# Altium project SmartSocket V1.0.PrjPcb (part 1 of 3)
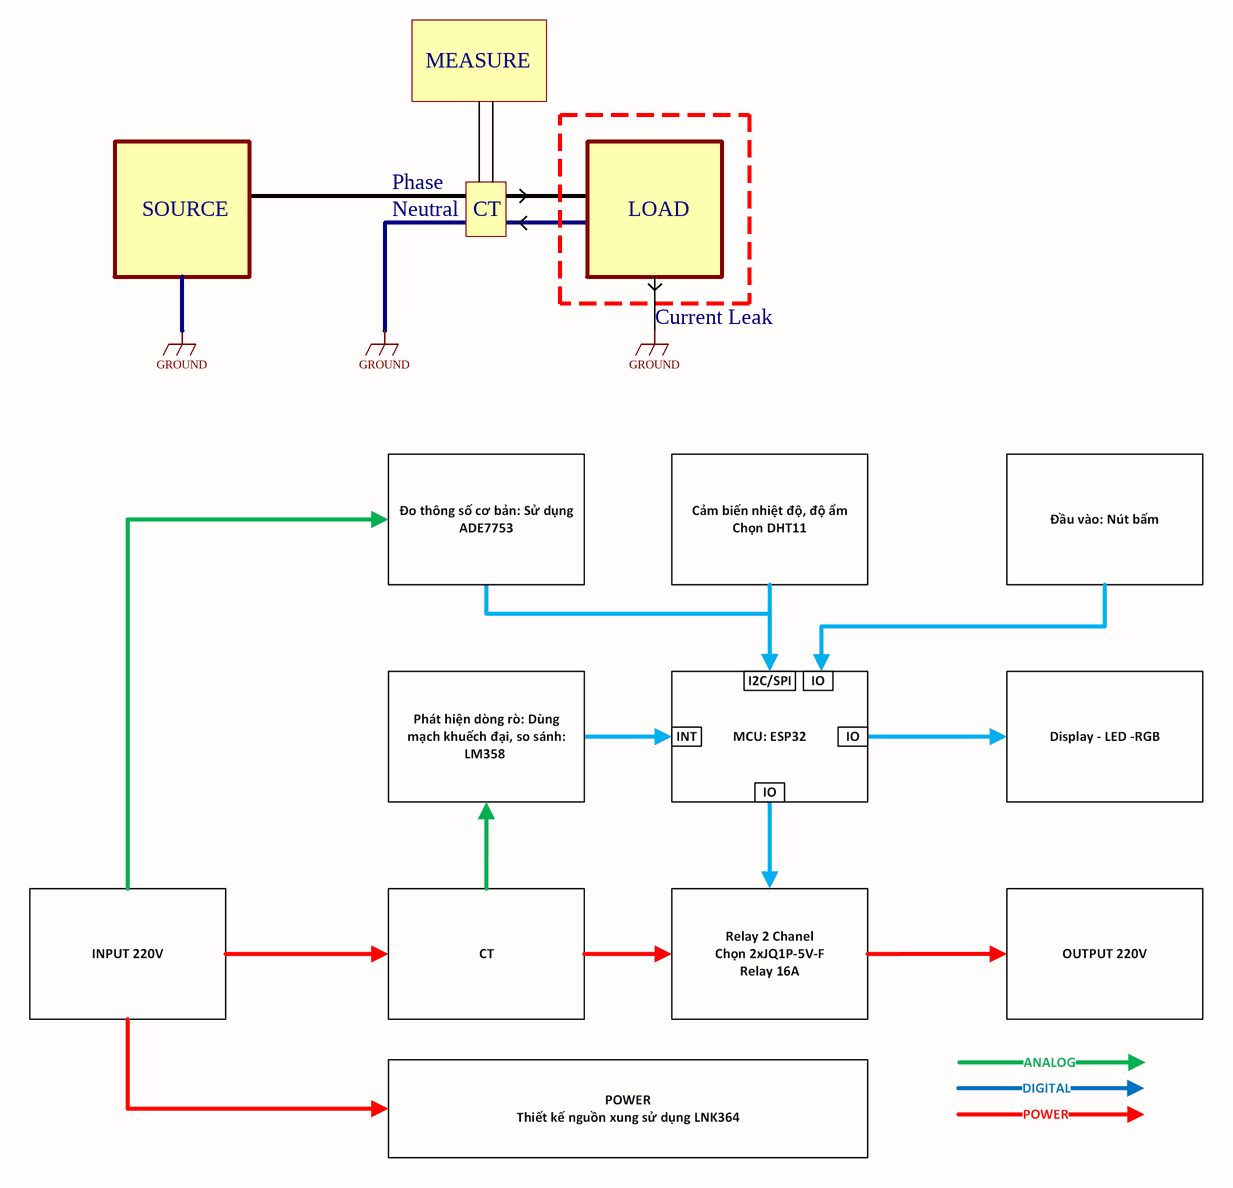
[diagram p0: DiagramElectical.SchDoc]
2 sheets, 117 parts. Net scope: global (net labels, ports and power ports of the same name join across sheets).
Board file: SmartSocket V1.0.PcbDoc
Sheets:
  DiagramElectical.SchDoc
  SmartSocket V1.0.SchDoc

## Sheet DiagramElectical.SchDoc
size A3; SheetNumber: 4; SheetTotal: 5

### Notes on the sheet
- MEASURE
- SOURCE
- Phase
- Neutral
- CT
- LOAD
- Current Leak
- Labels drawn without touching a wire or pin: GROUND

## Sheet SmartSocket V1.0.SchDoc
size A2; SheetNumber: 3; SheetTotal: 3
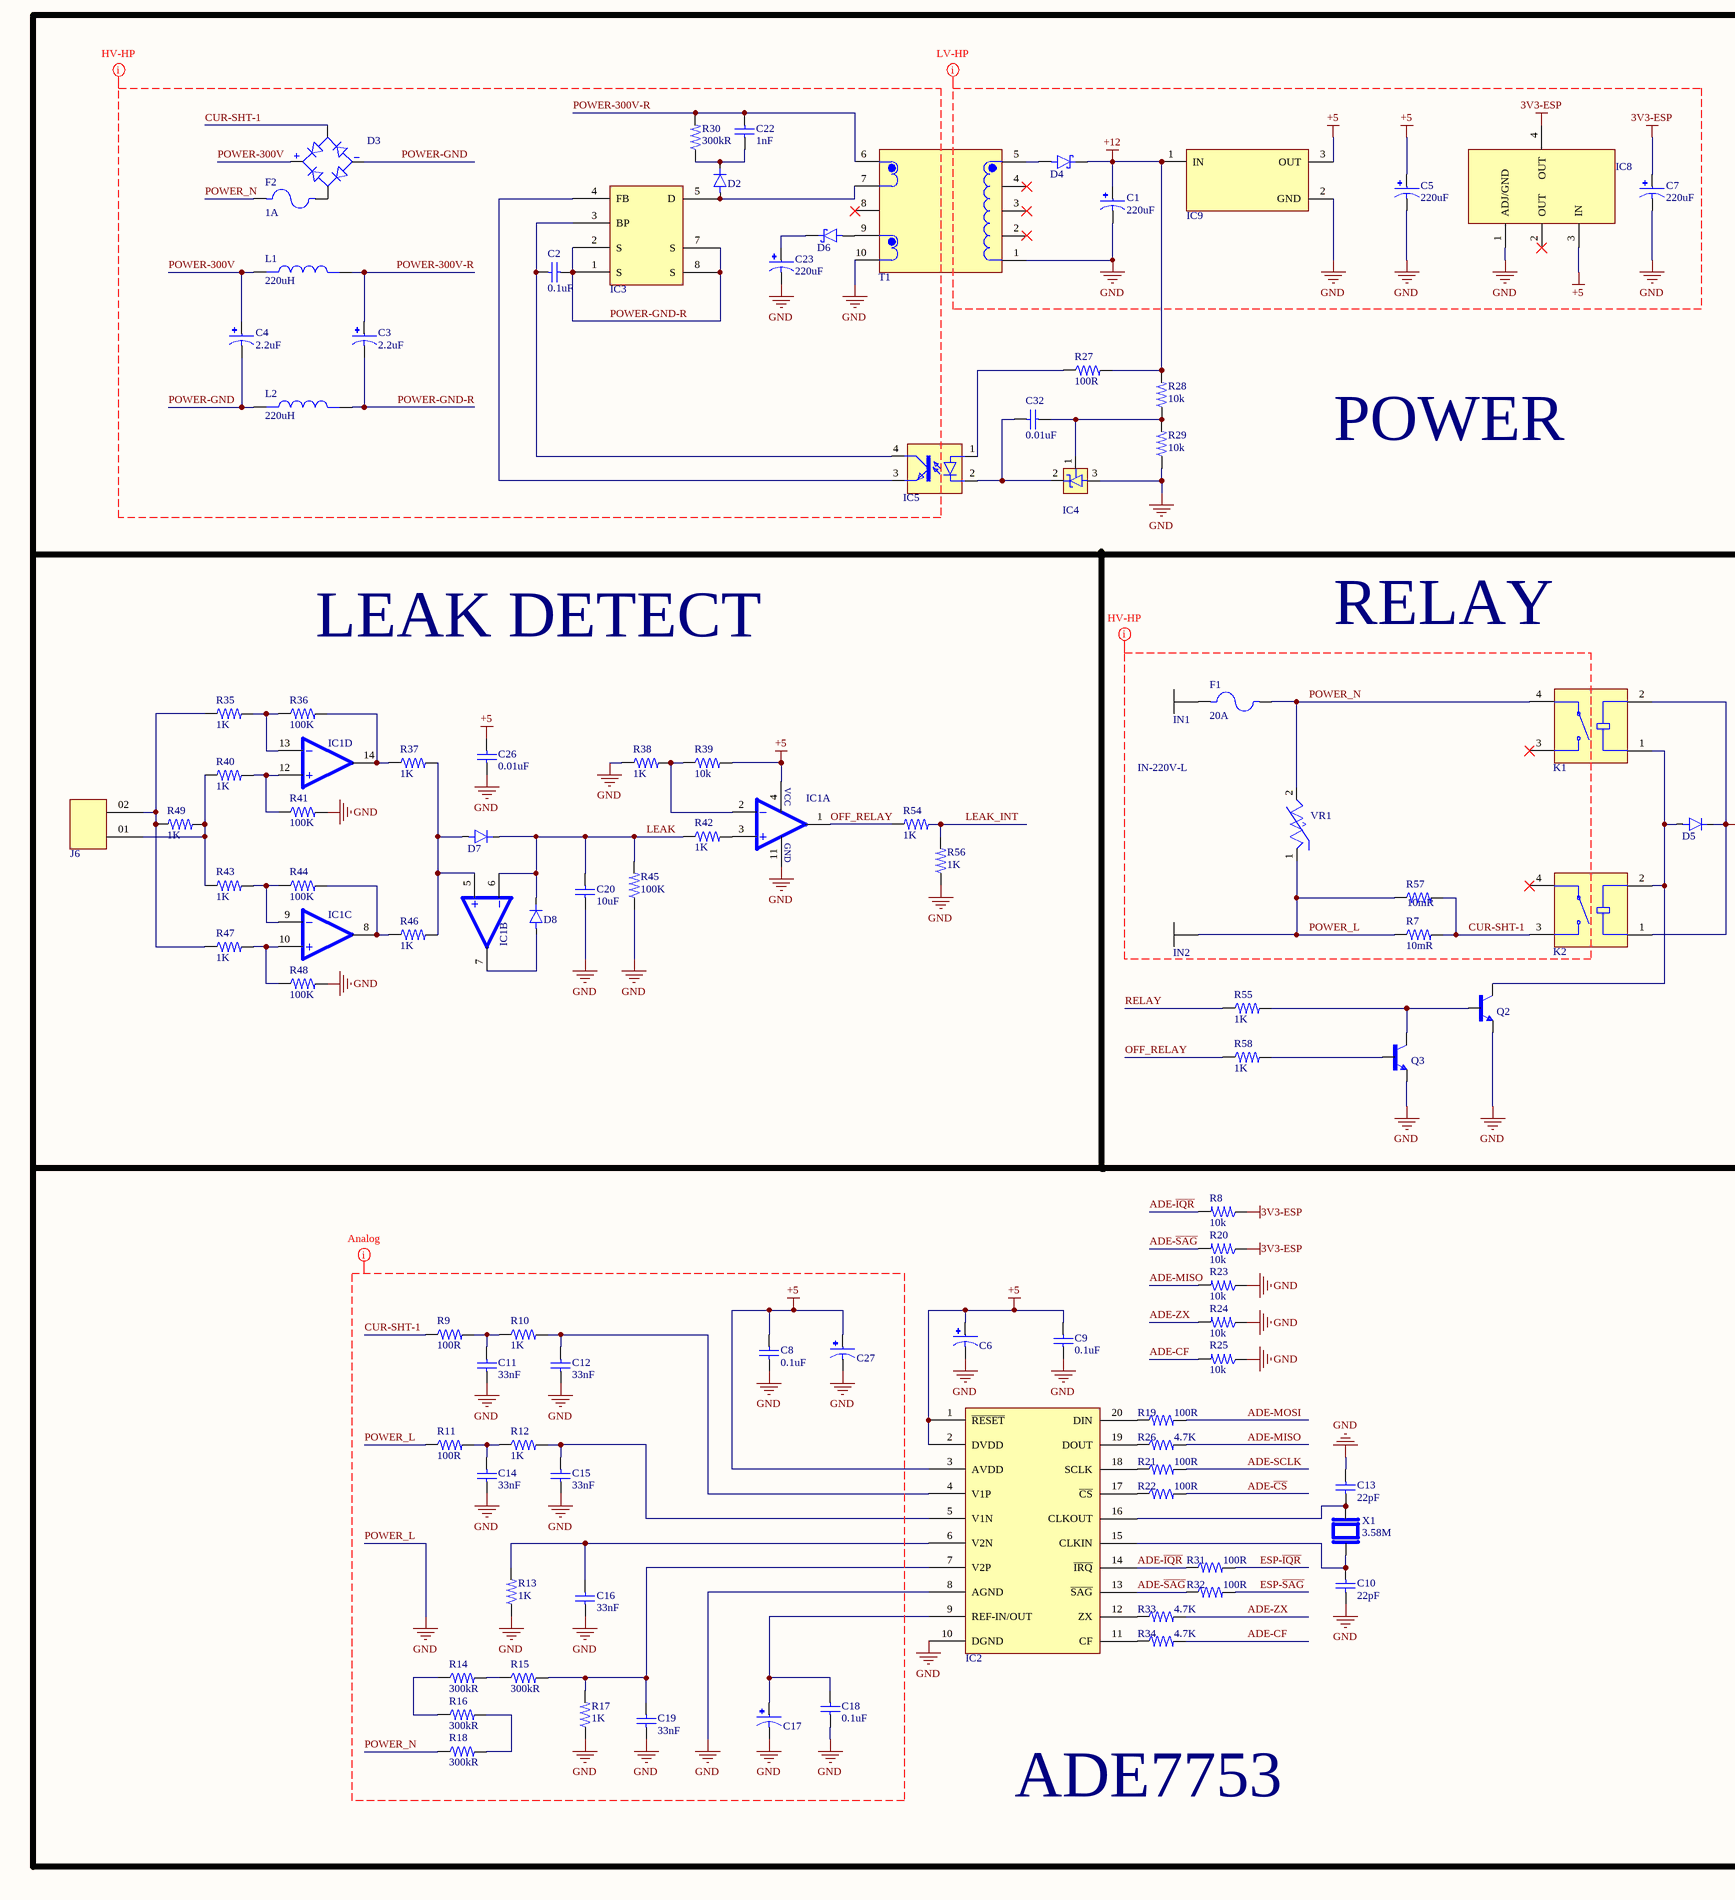
[diagram p1: SmartSocket V1.0.SchDoc, left]
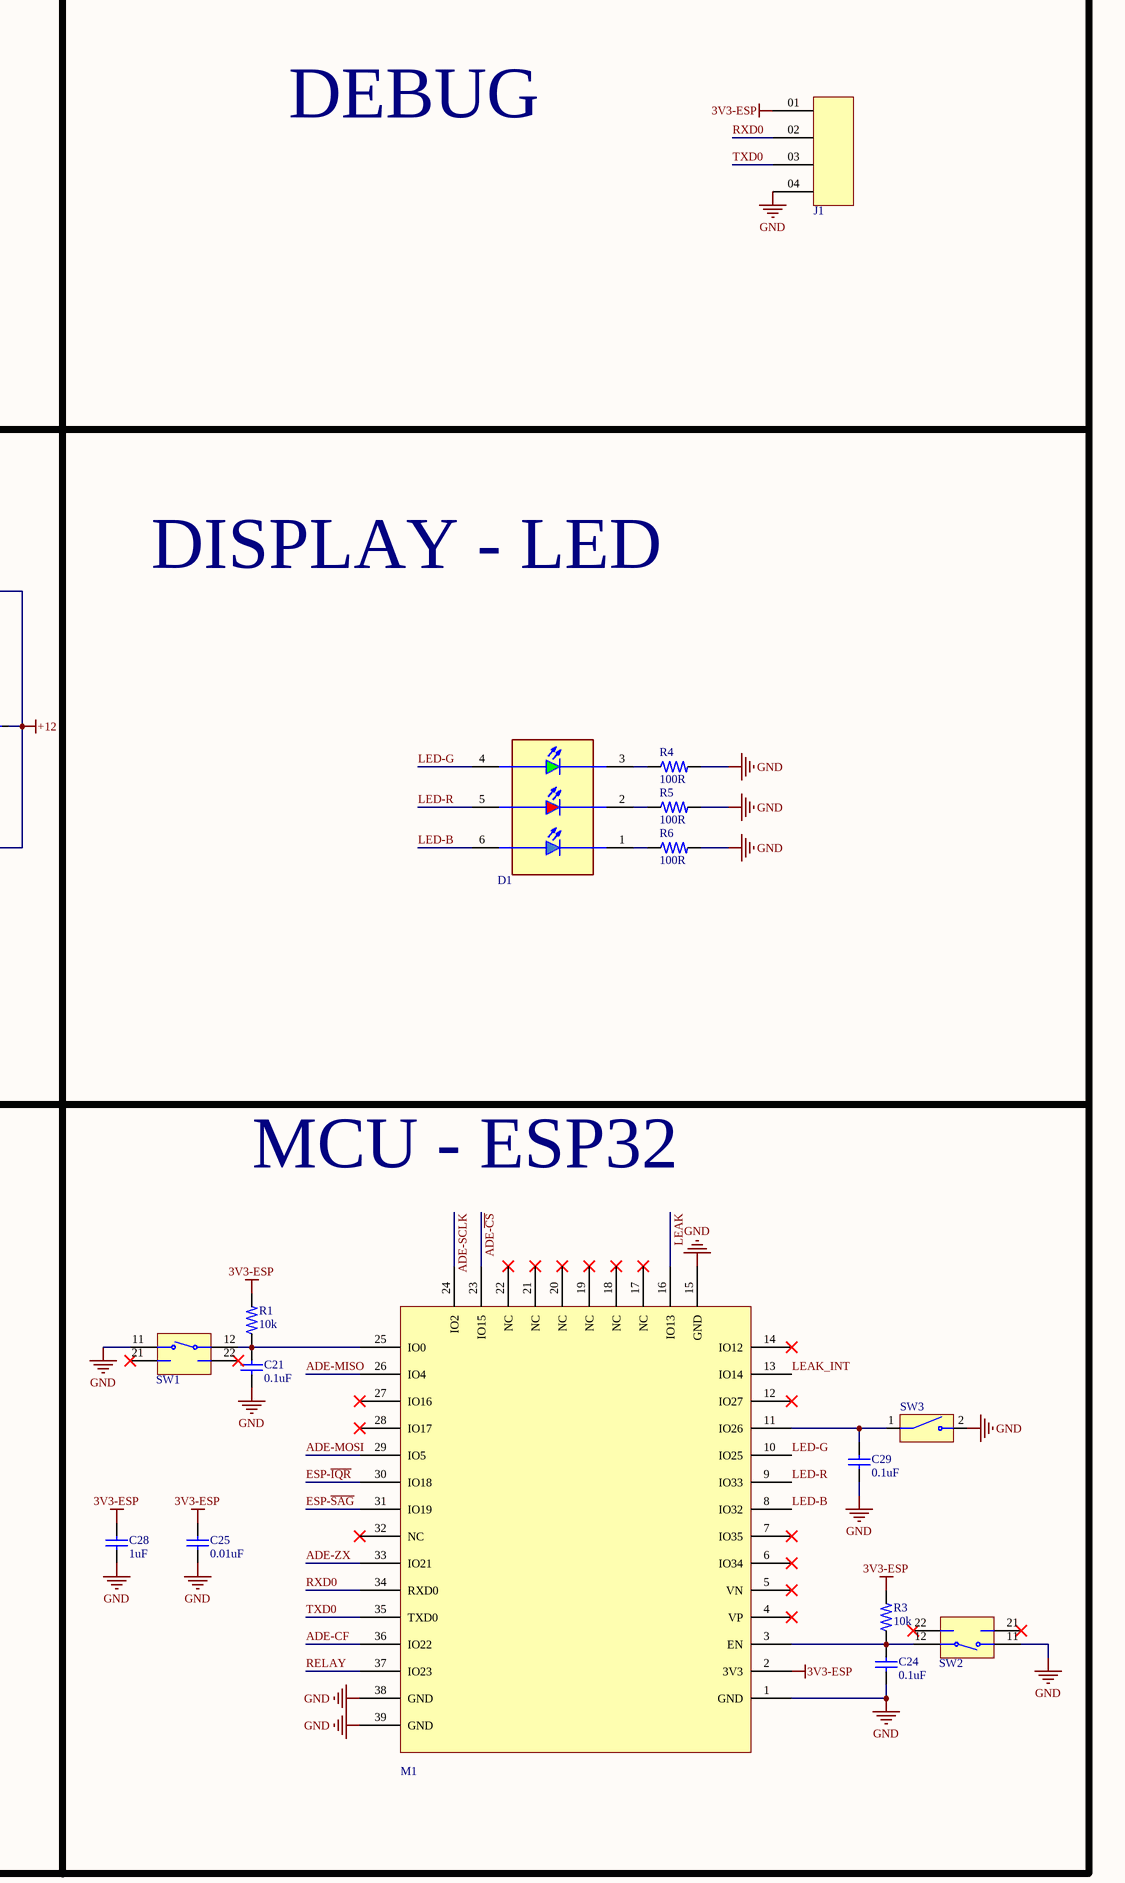
[diagram p2: SmartSocket V1.0.SchDoc, right]

### Parts
C1  value 220uF  [SMD-DxLxW-6.3x6.6x6.6-PEC]  (hidden comment: 220 µF 16 V Aluminum - Polymer Capacitors Radial, Can - SMD 22mOhm 1000 Hrs @ 125°C)
C2  value 0.1uF  [SMD-CAP-0603-YAGEO]  (hidden comment: 0.1 µF ±5% 50V Ceramic Capacitor X7R 0603 (1608 Metric))
C3  value 2.2uF  [TH-CAP-HxD-12.5x8.0-PEC]  (hidden comment: 2.2 µF 400 V Aluminum Electrolytic Capacitors Radial, Can 2000 Hrs @ 85°C)
C4  value 2.2uF  [TH-CAP-HxD-12.5x8.0-PEC]  (hidden comment: 2.2 µF 400 V Aluminum Electrolytic Capacitors Radial, Can 2000 Hrs @ 85°C)
C5  value 220uF  [SMD-DxLxW-6.3x6.6x6.6-PEC]  (hidden comment: 220 µF 16 V Aluminum - Polymer Capacitors Radial, Can - SMD 22mOhm 1000 Hrs @ 125°C)
C6  10 µF Molded Tantalum Capacitors 10 V 1206 (3216 Metric) 3.8Ohm  [SMD-CAP-TAN-1206-KEMET]  (value not drawn)
C7  value 220uF  [SMD-DxLxW-6.3x6.6x6.6-PEC]  (hidden comment: 220 µF 10 V Aluminum - Polymer Capacitors Radial, Can - SMD 20mOhm 2000 Hrs @ 105°C)
C8  value 0.1uF  [SMD-CAP-0603-YAGEO]  (hidden comment: 0.1 µF ±10% 16V Ceramic Capacitor X7R 0603 (1608 Metric))
C9  value 0.1uF  [SMD-CAP-0603-YAGEO]  (hidden comment: 0.1 µF ±10% 16V Ceramic Capacitor X7R 0603 (1608 Metric))
C10  value 22pF  [SMD-CAP-0603-YAGEO]  (hidden comment: 22 pF ±1% 50V Ceramic Capacitor C0G, NP0 0603 (1608 Metric))
C11  value 33nF  [SMD-CAP-0603-KEMET]  (hidden comment: 0.033 µF ±5% 16V Ceramic Capacitor X7R 0603 (1608 Metric))
C12  value 33nF  [SMD-CAP-0603-KEMET]  (hidden comment: 0.033 µF ±5% 16V Ceramic Capacitor X7R 0603 (1608 Metric))
C13  value 22pF  [SMD-CAP-0603-YAGEO]  (hidden comment: 22 pF ±1% 50V Ceramic Capacitor C0G, NP0 0603 (1608 Metric))
C14  value 33nF  [SMD-CAP-0603-KEMET]  (hidden comment: 0.033 µF ±5% 16V Ceramic Capacitor X7R 0603 (1608 Metric))
C15  value 33nF  [SMD-CAP-0603-KEMET]  (hidden comment: 0.033 µF ±5% 16V Ceramic Capacitor X7R 0603 (1608 Metric))
C16  value 33nF  [SMD-CAP-0603-KEMET]  (hidden comment: 0.033 µF ±5% 16V Ceramic Capacitor X7R 0603 (1608 Metric))
C17  10 µF Molded Tantalum Capacitors 10 V 1206 (3216 Metric) 3.8Ohm  [SMD-CAP-TAN-1206-KEMET]  (value not drawn)
C18  value 0.1uF  [SMD-CAP-0603-YAGEO]  (hidden comment: 0.1 µF ±10% 16V Ceramic Capacitor X7R 0603 (1608 Metric))
C19  value 33nF  [SMD-CAP-0603-KEMET]  (hidden comment: 0.033 µF ±5% 16V Ceramic Capacitor X7R 0603 (1608 Metric))
C20  value 10uF  [SMD-CAP-0805-KEMET]  (hidden comment: 10 µF ±10% 6.3V Ceramic Capacitor X5R 0805 (2012 Metric))
C21  value 0.1uF  [SMD-CAP-0603-YAGEO]  (hidden comment: 0.1 µF ±5% 25V Ceramic Capacitor X7R 0603 (1608 Metric))
C22  value 1nF  [TH-CAP-HxLxW-5.5x4.0x2.5-TDKC]  (hidden comment: 1000 pF ±5% 50V Ceramic Capacitor C0G, NP0 Radial)
C23  value 220uF  [SMD-DxLxW-8.0x8.3x8.3-PEC]  (hidden comment: 220 µF 25 V Aluminum - Polymer Capacitors Radial, Can - SMD 27mOhm 10000 Hrs @ 105°C)
C24  value 0.1uF  [SMD-CAP-0603-YAGEO]  (hidden comment: 0.1 µF ±5% 25V Ceramic Capacitor X7R 0603 (1608 Metric))
C25  value 0.01uF  [SMD-CAP-0603-YAGEO]  (hidden comment: 0.1 µF ±10% 10V Ceramic Capacitor X7R 0603 (1608 Metric))
C26  value 0.01uF  [SMD-CAP-0603-YAGEO]  (hidden comment: 0.1 µF ±10% 10V Ceramic Capacitor X7R 0603 (1608 Metric))
C27  10 µF Molded Tantalum Capacitors 10 V 1206 (3216 Metric) 3.8Ohm  [SMD-CAP-TAN-1206-KEMET]  (value not drawn)
C28  value 1uF  [SMD-CAP-0603-YAGEO]  (hidden comment: 1 µF ±10% 16V Ceramic Capacitor X7R 0603 (1608 Metric))
C29  value 0.1uF  [SMD-CAP-0603-YAGEO]  (hidden comment: 0.1 µF ±5% 25V Ceramic Capacitor X7R 0603 (1608 Metric))
C32  value 0.01uF  [SMD-CAP-0603-YAGEO]  (hidden comment: 10000 pF ±5% 25V Ceramic Capacitor X7R 0603 (1608 Metric))
D1  Red, Green, Blue (RGB) 625nm Red, 525nm Green, 568nm Blue LED Indication - Discrete 2V Red, 3.2V Green, 3.3V Blue 6-SMD, J-Lead  [SMD-HxLxW-1.6x5.0x5.0-ABOC]  (value not drawn)
D2  Diode 1000 V 1A Surface Mount SOD-123FL  [SOD-123FL-SMCDS]  (value not drawn)
D3  Bridge Rectifier Single Phase Standard 1 kV Surface Mount ABS  [DIODE-SMD-4-TSC]  (value not drawn)
D4  Diode 40 V 3A Surface Mount DO-214AC (SMA)  [SMD-DO-214AC-214-CT]  (value not drawn)
D5  Diode 1000 V 1A Surface Mount SOD-123FL  [SOD-123FL-SMCDS]  (value not drawn)
D6  Diode 40 V 3A Surface Mount DO-214AC (SMA)  [SMD-DO-214AC-214-CT]  (value not drawn)
D7  Diode 1000 V 1A Surface Mount SOD-123FL  [SOD-123FL-SMCDS]  (value not drawn)
D8  Diode 1000 V 1A Surface Mount SOD-123FL  [SOD-123FL-SMCDS]  (value not drawn)
F1  value 20A  [FUSE-5mmx20mm-AXIAL-BFI]  (hidden comment: 20 A 600 V AC 500 V DC Fuse Cartridge, Ceramic Through Hole 5mm x 20mm (Axial))
F2  value 1A  [FUSE-HxLxW-8.0x8.5x4.0-LI]  (hidden comment: 1 A 300 V AC DC Fuse Board Mount (Cartridge Style Excluded) Through Hole Radial, Box)
IC1  General Purpose Amplifier 4 Circuit 14-SOIC  [SOIC-14]  (value not drawn)  (parts A,B,C,D of 4)
IC2  Single Phase Meter IC 20-SSOP  [SSOP-20-ADI]  (value not drawn)
IC3  Converter Offline Flyback Topology 132kHz SMD-8B  [SMD-8B-PI]  (value not drawn)
IC4  Shunt Voltage Reference IC Adjustable 2.495V 36 VV ±1% 100 mA SOT-23-3  [SOT-23-3-DS]  (value not drawn)
IC5  Optoisolator Transistor Output 3750Vrms 1 Channel 4-SOP (2.54mm)  [SOP-4]  (value not drawn)
IC8  Linear Voltage Regulator IC Positive Fixed 1 Output 1A SOT-223-3  [SOT-223-3-DI]  (value not drawn)
IC9  Linear Voltage Regulator IC Positive Fixed 1 Output 1A TO-252  [TO252-3-RS]  (value not drawn)
IN1  INPUT  [INPUT-2.0x3.5]  (value not drawn)
IN2  INPUT  [INPUT-2.0x3.5]  (value not drawn)
J1  Connector Header Through Hole 4 position 0.100" (2.54mm)  [HEADER-2.54-4]  (value not drawn)
J6  Connector Header Through Hole 2 position  [HEADER-2.54-2]  (value not drawn)
K1  General Purpose Relay SPST-NO (1 Form A) 12VDC Coil Through Hole  [RELAY-HxLxW-23.5x30.5x15.7-OEIEMCD-D]  (value not drawn)
K2  General Purpose Relay SPST-NO (1 Form A) 12VDC Coil Through Hole  [RELAY-HxLxW-23.5x30.5x15.7-OEIEMCD-D]  (value not drawn)
L1  value 220uH  [SMD-HxLxW-1.8x4.0x4.0-ALLC]  (hidden comment: 220 µH Shielded Drum Core, Wirewound Inductor 250 mA 3.84Ohm Max Nonstandard)
L2  value 220uH  [SMD-HxLxW-1.8x4.0x4.0-ALLC]  (hidden comment: 220 µH Shielded Drum Core, Wirewound Inductor 250 mA 3.84Ohm Max Nonstandard)
M1  Bluetooth, WiFi 802.11b/g/n, Bluetooth v4.2 +EDR, Class 1, 2 and 3 Transceiver Module 2.4GHz ~ 2.5GHz Integrated, Trace Surface Mount  [MODULE-ESP32-WROVER - WROOM]  (value not drawn)
Q2  Bipolar (BJT) Transistor NPN 45 V 500 mA 100MHz 300 mW Surface Mount SOT-23-3 (TO-236)  [SOT-23-3-ONSEMI]  (value not drawn)
Q3  Bipolar (BJT) Transistor NPN 45 V 500 mA 100MHz 300 mW Surface Mount SOT-23-3 (TO-236)  [SOT-23-3-ONSEMI]  (value not drawn)
R1  value 10k  [SMD-RES-0603-SEI]  (hidden comment: 10 kOhms ±1% 0.25W, 1/4W Chip Resistor 0603 (1608 Metric) Automotive AEC-Q200, Pulse Withstanding Thick Film)
R3  value 10k  [SMD-RES-0603-SEI]  (hidden comment: 10 kOhms ±1% 0.25W, 1/4W Chip Resistor 0603 (1608 Metric) Automotive AEC-Q200, Pulse Withstanding Thick Film)
R4  value 100R  [SMD-RES-0603-RS]  (hidden comment: 100 Ohms ±1% 0.1W, 1/10W Chip Resistor 0603 (1608 Metric) Automotive AEC-Q200, High Voltage Thick Film)
R5  value 100R  [SMD-RES-0603-RS]  (hidden comment: 100 Ohms ±1% 0.1W, 1/10W Chip Resistor 0603 (1608 Metric) Automotive AEC-Q200, High Voltage Thick Film)
R6  value 100R  [SMD-RES-0603-RS]  (hidden comment: 100 Ohms ±1% 0.1W, 1/10W Chip Resistor 0603 (1608 Metric) Automotive AEC-Q200, High Voltage Thick Film)
R7  value 10mR  [SMD-RES-2512-VD]  (hidden comment: 10 mOhms ±1% 3W Chip Resistor 2512 (6432 Metric) Automotive AEC-Q200, Current Sense, Moisture Resistant Metal Film)
R8  value 10k  [SMD-RES-0603-SEI]  (hidden comment: 10 kOhms ±1% 0.25W, 1/4W Chip Resistor 0603 (1608 Metric) Automotive AEC-Q200, Pulse Withstanding Thick Film)
R9  value 100R  [SMD-RES-0603-RS]  (hidden comment: 100 Ohms ±1% 0.1W, 1/10W Chip Resistor 0603 (1608 Metric) Automotive AEC-Q200, High Voltage Thick Film)
R10  value 1K  [SMD-RES-0603-SEI]  (hidden comment: 1 kOhms ±1% 0.25W, 1/4W Chip Resistor 0603 (1608 Metric) Automotive AEC-Q200, Pulse Withstanding Thick Film)
R11  value 100R  [SMD-RES-0603-RS]  (hidden comment: 100 Ohms ±1% 0.1W, 1/10W Chip Resistor 0603 (1608 Metric) Automotive AEC-Q200, High Voltage Thick Film)
R12  value 1K  [SMD-RES-0603-SEI]  (hidden comment: 1 kOhms ±1% 0.25W, 1/4W Chip Resistor 0603 (1608 Metric) Automotive AEC-Q200, Pulse Withstanding Thick Film)
R13  value 1K  [SMD-RES-0603-SEI]  (hidden comment: 1 kOhms ±1% 0.25W, 1/4W Chip Resistor 0603 (1608 Metric) Automotive AEC-Q200, Pulse Withstanding Thick Film)
R14  value 300kR  [SMD-RES-0603-RS]  (hidden comment: 300 kOhms ±1% 0.1W, 1/10W Chip Resistor 0603 (1608 Metric) Automotive AEC-Q200, High Voltage Thick Film)
R15  value 300kR  [SMD-RES-0603-RS]  (hidden comment: 300 kOhms ±1% 0.1W, 1/10W Chip Resistor 0603 (1608 Metric) Automotive AEC-Q200, High Voltage Thick Film)
R16  value 300kR  [SMD-RES-0603-RS]  (hidden comment: 300 kOhms ±1% 0.1W, 1/10W Chip Resistor 0603 (1608 Metric) Automotive AEC-Q200, High Voltage Thick Film)
R17  value 1K  [SMD-RES-0603-SEI]  (hidden comment: 1 kOhms ±1% 0.25W, 1/4W Chip Resistor 0603 (1608 Metric) Automotive AEC-Q200, Pulse Withstanding Thick Film)
R18  value 300kR  [SMD-RES-0603-RS]  (hidden comment: 300 kOhms ±1% 0.1W, 1/10W Chip Resistor 0603 (1608 Metric) Automotive AEC-Q200, High Voltage Thick Film)
R19  value 100R  [SMD-RES-0603-RS]  (hidden comment: 100 Ohms ±1% 0.1W, 1/10W Chip Resistor 0603 (1608 Metric) Automotive AEC-Q200, High Voltage Thick Film)
R20  value 10k  [SMD-RES-0603-SEI]  (hidden comment: 10 kOhms ±1% 0.25W, 1/4W Chip Resistor 0603 (1608 Metric) Automotive AEC-Q200, Pulse Withstanding Thick Film)
R21  value 100R  [SMD-RES-0603-RS]  (hidden comment: 100 Ohms ±1% 0.1W, 1/10W Chip Resistor 0603 (1608 Metric) Automotive AEC-Q200, High Voltage Thick Film)
R22  value 100R  [SMD-RES-0603-RS]  (hidden comment: 100 Ohms ±1% 0.1W, 1/10W Chip Resistor 0603 (1608 Metric) Automotive AEC-Q200, High Voltage Thick Film)
R23  value 10k  [SMD-RES-0603-SEI]  (hidden comment: 10 kOhms ±1% 0.25W, 1/4W Chip Resistor 0603 (1608 Metric) Automotive AEC-Q200, Pulse Withstanding Thick Film)
R24  value 10k  [SMD-RES-0603-SEI]  (hidden comment: 10 kOhms ±1% 0.25W, 1/4W Chip Resistor 0603 (1608 Metric) Automotive AEC-Q200, Pulse Withstanding Thick Film)
R25  value 10k  [SMD-RES-0603-SEI]  (hidden comment: 10 kOhms ±1% 0.25W, 1/4W Chip Resistor 0603 (1608 Metric) Automotive AEC-Q200, Pulse Withstanding Thick Film)
R26  value 4.7K  [SMD-RES-0603-RS]  (hidden comment: 4.7 kOhms ±1% 0.1W, 1/10W Chip Resistor 0603 (1608 Metric) Anti-Sulfur Thick Film)
R27  value 100R  [SMD-RES-0603-RS]  (hidden comment: 100 Ohms ±1% 0.1W, 1/10W Chip Resistor 0603 (1608 Metric) Automotive AEC-Q200, High Voltage Thick Film)
R28  value 10k  [SMD-RES-0603-SEI]  (hidden comment: 10 kOhms ±1% 0.25W, 1/4W Chip Resistor 0603 (1608 Metric) Automotive AEC-Q200, Pulse Withstanding Thick Film)
R29  value 10k  [SMD-RES-0603-SEI]  (hidden comment: 10 kOhms ±1% 0.25W, 1/4W Chip Resistor 0603 (1608 Metric) Automotive AEC-Q200, Pulse Withstanding Thick Film)
R30  value 300kR  [SMD-RES-1206-RS]  (hidden comment: 300 kOhms ±1% 0.5W, 1/2W Chip Resistor 1206 (3216 Metric) Automotive AEC-Q200, Pulse Withstanding Thick Film)
R31  value 100R  [SMD-RES-0603-RS]  (hidden comment: 100 Ohms ±1% 0.1W, 1/10W Chip Resistor 0603 (1608 Metric) Automotive AEC-Q200, High Voltage Thick Film)
R32  value 100R  [SMD-RES-0603-RS]  (hidden comment: 100 Ohms ±1% 0.1W, 1/10W Chip Resistor 0603 (1608 Metric) Automotive AEC-Q200, High Voltage Thick Film)
R33  value 4.7K  [SMD-RES-0603-RS]  (hidden comment: 4.7 kOhms ±1% 0.1W, 1/10W Chip Resistor 0603 (1608 Metric) Anti-Sulfur Thick Film)
R34  value 4.7K  [SMD-RES-0603-RS]  (hidden comment: 4.7 kOhms ±1% 0.1W, 1/10W Chip Resistor 0603 (1608 Metric) Anti-Sulfur Thick Film)
R35  value 1K  [SMD-RES-0603-SEI]  (hidden comment: 1 kOhms ±1% 0.25W, 1/4W Chip Resistor 0603 (1608 Metric) Automotive AEC-Q200, Pulse Withstanding Thick Film)
R36  value 100K  [SMD-RES-0603-SEI]  (hidden comment: 100 kOhms ±5% 0.25W, 1/4W Chip Resistor 0603 (1608 Metric) Automotive AEC-Q200, Pulse Withstanding Thick Film)
R37  value 1K  [SMD-RES-0603-SEI]  (hidden comment: 1 kOhms ±1% 0.25W, 1/4W Chip Resistor 0603 (1608 Metric) Automotive AEC-Q200, Pulse Withstanding Thick Film)
R38  value 1K  [SMD-RES-0603-SEI]  (hidden comment: 1 kOhms ±1% 0.25W, 1/4W Chip Resistor 0603 (1608 Metric) Automotive AEC-Q200, Pulse Withstanding Thick Film)
R39  value 10k  [SMD-RES-0603-SEI]  (hidden comment: 10 kOhms ±1% 0.25W, 1/4W Chip Resistor 0603 (1608 Metric) Automotive AEC-Q200, Pulse Withstanding Thick Film)
R40  value 1K  [SMD-RES-0603-SEI]  (hidden comment: 1 kOhms ±1% 0.25W, 1/4W Chip Resistor 0603 (1608 Metric) Automotive AEC-Q200, Pulse Withstanding Thick Film)
R41  value 100K  [SMD-RES-0603-SEI]  (hidden comment: 100 kOhms ±5% 0.25W, 1/4W Chip Resistor 0603 (1608 Metric) Automotive AEC-Q200, Pulse Withstanding Thick Film)
R42  value 1K  [SMD-RES-0603-SEI]  (hidden comment: 1 kOhms ±1% 0.25W, 1/4W Chip Resistor 0603 (1608 Metric) Automotive AEC-Q200, Pulse Withstanding Thick Film)
R43  value 1K  [SMD-RES-0603-SEI]  (hidden comment: 1 kOhms ±1% 0.25W, 1/4W Chip Resistor 0603 (1608 Metric) Automotive AEC-Q200, Pulse Withstanding Thick Film)
R44  value 100K  [SMD-RES-0603-SEI]  (hidden comment: 100 kOhms ±5% 0.25W, 1/4W Chip Resistor 0603 (1608 Metric) Automotive AEC-Q200, Pulse Withstanding Thick Film)
R45  value 100K  [SMD-RES-0603-SEI]  (hidden comment: 100 kOhms ±5% 0.25W, 1/4W Chip Resistor 0603 (1608 Metric) Automotive AEC-Q200, Pulse Withstanding Thick Film)
R46  value 1K  [SMD-RES-0603-SEI]  (hidden comment: 1 kOhms ±1% 0.25W, 1/4W Chip Resistor 0603 (1608 Metric) Automotive AEC-Q200, Pulse Withstanding Thick Film)
R47  value 1K  [SMD-RES-0603-SEI]  (hidden comment: 1 kOhms ±1% 0.25W, 1/4W Chip Resistor 0603 (1608 Metric) Automotive AEC-Q200, Pulse Withstanding Thick Film)
R48  value 100K  [SMD-RES-0603-SEI]  (hidden comment: 100 kOhms ±5% 0.25W, 1/4W Chip Resistor 0603 (1608 Metric) Automotive AEC-Q200, Pulse Withstanding Thick Film)
R49  value 1K  [SMD-RES-0603-SEI]  (hidden comment: 1 kOhms ±1% 0.25W, 1/4W Chip Resistor 0603 (1608 Metric) Automotive AEC-Q200, Pulse Withstanding Thick Film)
R54  value 1K  [SMD-RES-0603-SEI]  (hidden comment: 1 kOhms ±1% 0.25W, 1/4W Chip Resistor 0603 (1608 Metric) Automotive AEC-Q200, Pulse Withstanding Thick Film)
R55  value 1K  [SMD-RES-0603-SEI]  (hidden comment: 1 kOhms ±1% 0.25W, 1/4W Chip Resistor 0603 (1608 Metric) Automotive AEC-Q200, Pulse Withstanding Thick Film)
R56  value 1K  [SMD-RES-0603-SEI]  (hidden comment: 1 kOhms ±1% 0.25W, 1/4W Chip Resistor 0603 (1608 Metric) Automotive AEC-Q200, Pulse Withstanding Thick Film)
R57  value 10mR  [SMD-RES-2512-VD]  (hidden comment: 10 mOhms ±1% 3W Chip Resistor 2512 (6432 Metric) Automotive AEC-Q200, Current Sense, Moisture Resistant Metal Film)
R58  value 1K  [SMD-RES-0603-SEI]  (hidden comment: 1 kOhms ±1% 0.25W, 1/4W Chip Resistor 0603 (1608 Metric) Automotive AEC-Q200, Pulse Withstanding Thick Film)
SW1  https://www.digikey.com/en/products/detail/panasonic-electronic-components/EVQ-P7L01P/4429453  [SW-HxLxW-1.1x3.5x2.9-PEC]  (value not drawn)
SW2  https://www.digikey.com/en/products/detail/panasonic-electronic-components/EVQ-P7L01P/4429453  [SW-HxLxW-1.1x3.5x2.9-PEC]  (value not drawn)
SW3  Tactile Switch SPST-NO Top Actuated Surface Mount  [SW-HxLxW-5.0x6.0x3.5-C&K]  (value not drawn)
T1  For SMPS Transformer 500VAC Isolation Through Hole  [EE13 - POWER]  (value not drawn)
VR1  470 V 8 kA Varistor 1 Circuit Through Hole Disc 20mm  [VARISTOR-ETE]  (value not drawn)
X1  value 3.58M  [SMD-HC-49/US-ALLC]  (hidden comment: 3.579545 MHz ±20ppm Crystal 18pF 180 Ohms HC-49/US)

### Nets
3V3-ESP: C7.1 C25.2 C28.2 IC8.4(OUT) J1.01 M1.2(3V3) R1.2 R3.2 R8.1 R20.1
+5: C5.1 C6.1 C8.2 C9.2 C26.2 C27.1 IC1.4(VCC) IC2.1(~{RESET}) IC2.2(DVDD) IC2.3(AVDD) IC8.3(IN) IC9.3(OUT) R39.2
+12: C1.1 D4.1(K) D5.K IC9.1(IN) K1.2(COIL2) K2.1(COIL1) R27.2 R28.2
POWER_L: C1.2 C5.2 C6.2 C7.2 C8.1 C9.1 C10.2 C11.1 C12.1 C13.1 C14.1 C15.1 C16.1 C17.2 C18.1 C19.1 C20.1 C21.1 C23.2 C24.1 C25.1 C26.1 C27.2 C28.1 C29.1 IC1.11(GND) IC2.8(AGND) IC2.10(DGND) IC4.3(ANODE) IC8.1(ADJ/GND) IC9.2(GND) IN2.1(IN) J1.04 M1.1(GND) M1.15(GND) M1.38(GND) M1.39(GND) Q2.2(E) Q3.2(E) R4.2 R5.2 R6.2 R7.1 R11.1 R13.1 R17.1 R23.1 R24.1 R25.1 R29.1 R38.1 R41.2 R45.1 R48.2 R56.1 R57.1 SW1.11 SW2.11 SW3.2(NO) T1.1 T1.10 VR1.1  [also labelled GND]
ADE-~{CS}: M1.23(IO15) R22.2
ADE-CF: M1.36(IO22) R25.2 R34.2
ADE-~{IQR}: IC2.14(~{IRQ}) R8.2 R31.1
ADE-MISO: M1.26(IO4) R23.2 R26.2
ADE-MOSI: M1.29(IO5) R19.2
ADE-~{SAG}: IC2.13(~{SAG}) R20.2 R32.1
ADE-SCLK: M1.24(IO2) R21.2
ADE-ZX: M1.33(IO21) R24.2 R33.2
CUR-SHT-1: D3.AC1 K2.3(COM) R7.2 R9.1 R57.2
ESP-~{IQR}: M1.30(IO18) R31.2
ESP-~{SAG}: M1.31(IO19) R32.2
LEAK: C20.2 D7.K D8.K IC1.6(2IN-) M1.16(IO13) R42.1 R45.2
LEAK_INT: M1.13(IO14) R54.2 R56.2
LED-B: D1.6(B_A) M1.8(IO32)
LED-G: D1.4(G_A) M1.10(IO25)
LED-R: D1.5(R_A) M1.9(IO33)
OFF_RELAY: IC1.1(1OUT) R54.1 R58.1
POWER-300V: C4.1 D3.POS L1.1
POWER-300V-R: C3.1 C22.2 L1.2 R30.2 T1.6
POWER-GND: C4.2 D3.NEG L2.1
POWER-GND-R: C2.2 C3.2 IC3.1(S) IC3.2(S) IC3.7(S) IC3.8(S) L2.2
POWER_N: F1.2 F2.1 K1.4(NO) R18.1 VR1.2
RELAY: M1.37(IO23) R55.1
RXD0: J1.02 M1.34(RXD0)
TXD0: J1.03 M1.35(TXD0)
NetC2_1: C2.1 IC3.3(BP) IC5.4(COL)
NetC10_1: C10.1 IC2.15(CLKIN) X1.2
NetC11_2: C11.2 R9.2 R10.1
NetC12_2: C12.2 IC2.4(V1P) R10.2
NetC13_2: C13.2 IC2.16(CLKOUT) X1.1
NetC14_2: C14.2 R11.2 R12.1
NetC15_2: C15.2 IC2.5(V1N) R12.2
NetC16_2: C16.2 IC2.6(V2N) R13.2
NetC17_1: C17.1 C18.2 IC2.9(REF-IN/OUT)
NetC19_2: C19.2 IC2.7(V2P) R15.2 R17.2
NetC21_2: C21.2 M1.25(IO0) R1.1 SW1.12
NetC22_1: C22.1 D2.K R30.1
NetC23_1: C23.1 D6.1(K)
NetC24_2: C24.2 M1.3(EN) R3.1 SW2.12
NetC29_2: C29.2 M1.11(IO26) SW3.1(COM)
NetC32_1: C32.1 IC4.2(CATHODE) IC5.2(C)
NetC32_2: C32.2 IC4.1(REF) R28.1 R29.2
NetD1_1: D1.1(B_C) R6.1
NetD1_2: D1.2(R_C) R5.1
NetD1_3: D1.3(G_C) R4.1
NetD2_A: D2.A IC3.5(D) T1.7
NetD3_AC2: D3.AC2 F2.2
NetD4_2: D4.2(A) T1.5
NetD5_A: D5.A K1.1(COIL1) K2.2(COIL2) Q2.3(C)
NetD6_2: D6.2(A) T1.9
NetD7_A: D7.A IC1.5(2IN+) R37.2 R46.2
NetD8_A: D8.A IC1.7(2OUT)
NetF1_1: F1.1 IN1.1(IN)
NetIC1_2: IC1.2(1IN-) R38.2 R39.1
NetIC1_3: IC1.3(1IN+) R42.2
NetIC1_8: IC1.8(3OUT) R44.2 R46.1
NetIC1_9: IC1.9(3IN-) R43.2 R44.1
NetIC1_10: IC1.10(3IN+) R47.2 R48.1
NetIC1_12: IC1.12(4IN+) R40.2 R41.1
NetIC1_13: IC1.13(4IN-) R35.2 R36.1
NetIC1_14: IC1.14(4OUT) R36.2 R37.1
NetIC2_11: IC2.11(CF) R34.1
NetIC2_12: IC2.12(ZX) R33.1
NetIC2_17: IC2.17(~{CS}) R22.1
NetIC2_18: IC2.18(SCLK) R21.1
NetIC2_19: IC2.19(DOUT) R26.1
NetIC2_20: IC2.20(DIN) R19.1
NetIC3_4: IC3.4(FB) IC5.3(EMIT)
NetIC5_1: IC5.1(A) R27.1
NetJ6_01: J6.01 R40.1 R43.1 R49.2
NetJ6_02: J6.02 R35.1 R47.1 R49.1
NetQ2_1: Q2.1(B) Q3.3(C) R55.2
NetQ3_1: Q3.1(B) R58.2
NetR14_1: R14.1 R16.1
NetR14_2: R14.2 R15.1
NetR16_2: R16.2 R18.2

Not connected (* = marked no-connect by the designer): IC8 2(OUT)*; K1 3(COM)*; K2 4(NO)*; M1 4(VP)* 5(VN)* 6(IO34)* 7(IO35)* 12(IO27)* 14(IO12)* 17(NC)* 18(NC)* 19(NC)* 20(NC)* 21(NC)* 22(NC)* 27(IO16)* 28(IO17)* 32(NC)*; SW1 21(1)* 22(2)*; SW2 21(1)* 22(2)*; T1 2* 3* 4* 8*

### Layout directives
net class HV-HP: CUR-SHT-1, GND, POWER-300V, POWER-300V-R, POWER-GND, POWER-GND-R, POWER_L, POWER_N
net class LV-HP: 3V3-ESP, +5, +12, GND
net class Analog: +5, CUR-SHT-1, GND, POWER_L, POWER_N

### Notes on the sheet
- DEBUG
- POWER
- RELAY
- LEAK DETECT
- DISPLAY - LED
- IN-220V-L
- MCU - ESP32
- ADE7753